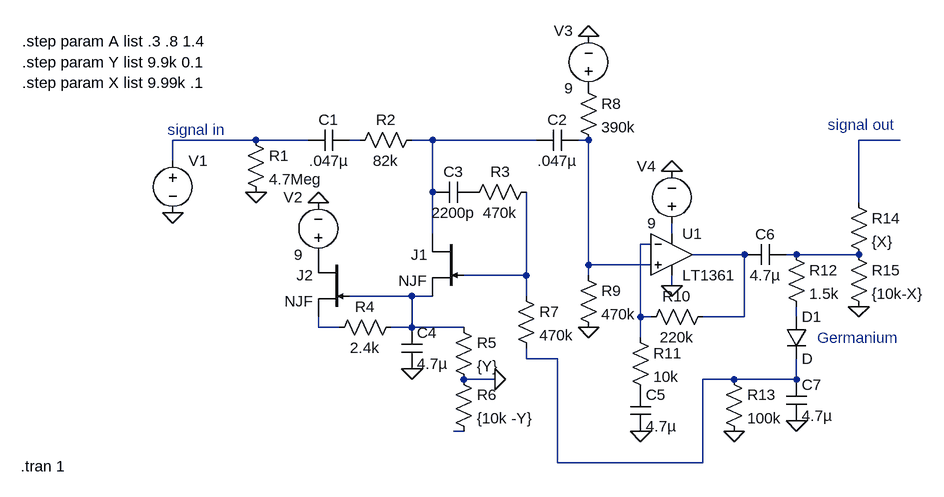
[diagram p0: schematic Orange_Squeezer_compressor.asc]
Orange_Squeezer_compressor.asc, the LTspice schematic file:
Version 4
SHEET 1 1344 680
WIRE 176 80 48 80
WIRE 256 80 176 80
WIRE 336 80 320 80
WIRE 448 80 416 80
WIRE 608 80 448 80
WIRE 688 80 672 80
WIRE 1168 80 1104 80
WIRE 48 112 48 80
WIRE 448 160 448 80
WIRE 1104 176 1104 80
WIRE 448 224 448 160
WIRE 816 224 816 208
WIRE 784 240 768 240
WIRE 928 256 848 256
WIRE 1008 256 992 256
WIRE 1104 256 1008 256
WIRE 688 272 688 80
WIRE 784 272 688 272
WIRE 592 288 592 160
WIRE 592 288 496 288
WIRE 688 288 688 272
WIRE 816 304 816 288
WIRE 416 320 320 320
WIRE 448 320 416 320
WIRE 592 320 592 288
WIRE 768 352 768 240
WIRE 784 352 768 352
WIRE 928 352 928 256
WIRE 928 352 864 352
WIRE 1008 352 1008 336
WIRE 272 368 272 352
WIRE 304 368 272 368
WIRE 416 368 416 320
WIRE 416 368 384 368
WIRE 496 368 416 368
WIRE 768 384 768 352
WIRE 592 416 592 400
WIRE 640 416 592 416
WIRE 544 448 496 448
WIRE 912 448 864 448
WIRE 1008 448 1008 416
WIRE 1008 448 912 448
WIRE 496 528 480 528
WIRE 640 576 640 416
WIRE 864 576 864 448
WIRE 864 576 640 576
FLAG 48 192 0
FLAG 176 160 0
FLAG 272 176 0
FLAG 544 448 0
FLAG 416 432 0
FLAG 688 -80 0
FLAG 688 368 0
FLAG 816 128 0
FLAG 816 304 0
FLAG 768 528 0
FLAG 1008 512 0
FLAG 912 528 0
FLAG 1104 336 0
SYMBOL voltage 48 96 R0
WINDOW 3 24 104 Invisible 0
WINDOW 123 0 0 Left 0
WINDOW 39 0 0 Left 0
SYMATTR InstName V1
SYMATTR Value SINE(0 {A} 400)
SYMBOL res 160 64 R0
SYMATTR InstName R1
SYMATTR Value 4.7Meg
SYMBOL cap 320 64 R90
WINDOW 0 0 32 VBottom 0
WINDOW 3 32 32 VTop 0
SYMATTR InstName C1
SYMATTR Value .047µ
SYMBOL res 432 64 R90
WINDOW 0 0 56 VBottom 0
WINDOW 3 32 56 VTop 0
SYMATTR InstName R2
SYMATTR Value 82k
SYMBOL cap 672 64 R90
WINDOW 0 0 32 VBottom 0
WINDOW 3 32 32 VTop 0
SYMATTR InstName C2
SYMATTR Value .047µ
SYMBOL cap 512 144 R90
WINDOW 0 0 32 VBottom 0
WINDOW 3 32 32 VTop 0
SYMATTR InstName C3
SYMATTR Value 2200p
SYMBOL njf 496 224 M0
SYMATTR InstName J1
SYMBOL res 608 144 R90
WINDOW 0 0 56 VBottom 0
WINDOW 3 32 56 VTop 0
SYMATTR InstName R3
SYMATTR Value 470k
SYMBOL njf 320 256 M0
SYMATTR InstName J2
SYMBOL voltage 272 272 R180
WINDOW 0 24 104 Left 0
WINDOW 3 24 16 Left 0
WINDOW 123 0 0 Left 0
WINDOW 39 0 0 Left 0
SYMATTR InstName V2
SYMATTR Value 9
SYMBOL res 400 352 R90
WINDOW 0 0 56 VBottom 0
WINDOW 3 32 56 VTop 0
SYMATTR InstName R4
SYMATTR Value 2.4k
SYMBOL cap 400 368 R0
SYMATTR InstName C4
SYMATTR Value 4.7µ
SYMBOL res 480 352 R0
SYMATTR InstName R5
SYMATTR Value {Y}
SYMBOL res 480 432 R0
SYMATTR InstName R6
SYMATTR Value {10k -Y}
SYMBOL res 576 304 R0
SYMATTR InstName R7
SYMATTR Value 470k
SYMBOL voltage 688 16 R180
WINDOW 0 24 104 Left 0
WINDOW 3 24 16 Left 0
WINDOW 123 0 0 Left 0
WINDOW 39 0 0 Left 0
SYMATTR InstName V3
SYMATTR Value 9
SYMBOL res 672 -16 R0
SYMATTR InstName R8
SYMATTR Value 390k
SYMBOL res 672 272 R0
SYMATTR InstName R9
SYMATTR Value 470k
SYMBOL Opamps\\LT1361 816 192 R0
SYMATTR InstName U1
SYMBOL voltage 816 224 R180
WINDOW 0 24 104 Left 0
WINDOW 3 24 16 Left 0
WINDOW 123 0 0 Left 0
WINDOW 39 0 0 Left 0
SYMATTR InstName V4
SYMATTR Value 9
SYMBOL res 880 336 R90
WINDOW 0 0 56 VBottom 0
WINDOW 3 32 56 VTop 0
SYMATTR InstName R10
SYMATTR Value 220k
SYMBOL res 752 368 R0
SYMATTR InstName R11
SYMATTR Value 10k
SYMBOL cap 752 464 R0
SYMATTR InstName C5
SYMATTR Value 4.7µ
SYMBOL cap 992 240 R90
WINDOW 0 0 32 VBottom 0
WINDOW 3 32 32 VTop 0
SYMATTR InstName C6
SYMATTR Value 4.7µ
SYMBOL res 992 240 R0
SYMATTR InstName R12
SYMATTR Value 1.5k
SYMBOL diode 992 352 R0
SYMATTR InstName D1
SYMBOL cap 992 448 R0
SYMATTR InstName C7
SYMATTR Value 4.7µ
SYMBOL res 896 432 R0
SYMATTR InstName R13
SYMATTR Value 100k
SYMBOL res 1088 160 R0
SYMATTR InstName R14
SYMATTR Value {X}
SYMBOL res 1088 240 R0
SYMATTR InstName R15
SYMATTR Value {10k-X}
TEXT -184 -40 Left 0 !.step param Y list 9.9k 0.1
TEXT 1040 384 Left 0 ;Germanium
TEXT -184 -8 Left 0 !.step param X list 9.99k .1
TEXT 1056 56 Left 0 ;signal out
TEXT 40 64 Left 0 ;signal in
TEXT -186 582 Left 0 !.tran 1
TEXT -184 -72 Left 0 !.step param A list .3 .8 1.4

The netlist it stands for:
* Orange_Squeezer_compressor.asc
V1 N001 0 SINE(0 {A} 400)
R1 N001 0 4.7Meg
C1 N002 N001 .047µ
R2 N003 N002 82k
C2 N004 N003 .047µ
C3 P001 N003 2200p
J1 N003 N010 N011 NJF
R3 N010 P001 470k
J2 P002 N011 N013 NJF
V2 P002 0 9
R4 N011 N013 2.4k
C4 N011 0 4.7µ
R5 N011 0 {Y}
R6 0 N015 {10k -Y}
R7 N010 N014 470k
V3 P003 0 9
R8 P003 N004 390k
R9 N004 0 470k
XU1 N004 N007 N006 0 N008 LT1361  ; pins In+ In- V+ V- OUT
V4 N006 0 9
R10 N008 N007 220k
R11 N007 P004 10k
C5 P004 0 4.7µ
C6 N009 N008 4.7µ
R12 N009 N012 1.5k
D1 N012 N014 D
C7 N014 0 4.7µ
R13 N014 0 100k
R14 N005 N009 {X}
R15 N009 0 {10k-X}
.model D D
.lib standard.dio
.model NJF NJF
.model PJF PJF
.lib standard.jft
.step param Y list 9.9k 0.1
* Germanium
.step param X list 9.99k .1
* signal out
* signal in
.tran 1
.step param A list .3 .8 1.4
.backanno
.end